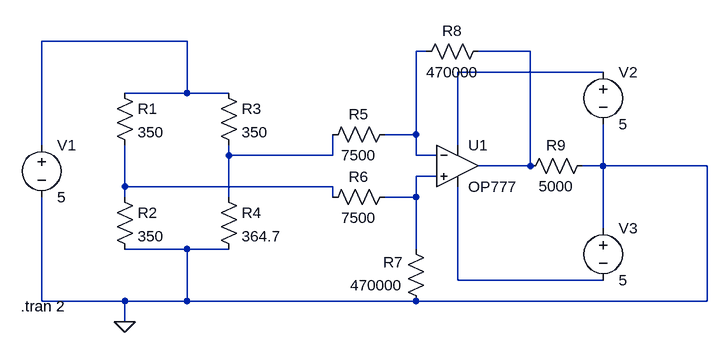
[diagram p0: schematic PuenteWGalgas.asc]
PuenteWGalgas.asc, the LTspice schematic file:
Version 4
SHEET 1 1060 680
WIRE 256 -16 32 -16
WIRE 624 0 608 0
WIRE 784 0 704 0
WIRE 896 32 672 32
WIRE 256 64 256 -16
WIRE 256 64 160 64
WIRE 320 64 256 64
WIRE 608 128 608 0
WIRE 608 128 560 128
WIRE 32 144 32 -16
WIRE 672 144 672 32
WIRE 320 160 320 144
WIRE 480 160 480 128
WIRE 480 160 320 160
WIRE 608 160 608 128
WIRE 640 160 608 160
WIRE 784 176 784 0
WIRE 784 176 704 176
WIRE 896 176 896 112
WIRE 896 176 864 176
WIRE 1056 176 896 176
WIRE 640 192 608 192
WIRE 160 208 160 144
WIRE 480 208 160 208
WIRE 160 224 160 208
WIRE 320 224 320 160
WIRE 480 224 480 208
WIRE 608 224 608 192
WIRE 608 224 560 224
WIRE 896 272 896 176
WIRE 256 304 160 304
WIRE 320 304 256 304
WIRE 608 304 608 224
WIRE 672 352 672 208
WIRE 896 352 672 352
WIRE 32 384 32 224
WIRE 160 384 32 384
WIRE 256 384 256 304
WIRE 256 384 160 384
WIRE 608 384 256 384
WIRE 1056 384 1056 176
WIRE 1056 384 608 384
WIRE 160 416 160 384
FLAG 160 416 0
SYMBOL voltage 32 128 R0
WINDOW 123 0 0 Left 0
WINDOW 39 0 0 Left 0
SYMATTR InstName V1
SYMATTR Value 5
SYMBOL res 144 48 R0
SYMATTR InstName R1
SYMATTR Value 350
SYMBOL res 144 208 R0
SYMATTR InstName R2
SYMATTR Value 350
SYMBOL res 304 48 R0
SYMATTR InstName R3
SYMATTR Value 350
SYMBOL res 304 208 R0
SYMATTR InstName R4
SYMATTR Value 364.7
SYMBOL res 576 112 R90
WINDOW 0 0 56 VBottom 2
WINDOW 3 32 56 VTop 2
SYMATTR InstName R5
SYMATTR Value 7500
SYMBOL res 576 208 R90
WINDOW 0 0 56 VBottom 2
WINDOW 3 32 56 VTop 2
SYMATTR InstName R6
SYMATTR Value 7500
SYMBOL res 624 400 R180
WINDOW 0 36 76 Left 2
WINDOW 3 36 40 Left 2
SYMATTR InstName R7
SYMATTR Value 470000
SYMBOL OpAmps\\OP777 672 112 R0
SYMATTR InstName U1
SYMBOL res 720 -16 R90
WINDOW 0 0 56 VBottom 2
WINDOW 3 32 56 VTop 2
SYMATTR InstName R8
SYMATTR Value 470000
SYMBOL res 880 160 R90
WINDOW 0 0 56 VBottom 2
WINDOW 3 32 56 VTop 2
SYMATTR InstName R9
SYMATTR Value 5000
SYMBOL voltage 896 16 R0
WINDOW 123 0 0 Left 0
WINDOW 39 0 0 Left 0
SYMATTR InstName V2
SYMATTR Value 5
SYMBOL voltage 896 256 R0
WINDOW 123 0 0 Left 0
WINDOW 39 0 0 Left 0
SYMATTR InstName V3
SYMATTR Value 5
TEXT 0 392 Left 2 !.tran 2

The netlist it stands for:
* PuenteWGalgas.asc
V1 N001 0 5
R1 N001 N007 350
R2 N007 0 350
R3 N001 N005 350
R4 N005 0 364.7
R5 N002 N005 7500
R6 N006 N007 7500
R7 0 N006 470000
XU1 N006 N002 N004 N008 N003 OP777  ; pins In+ In- V+ V- OUT
R8 N003 N002 470000
R9 0 N003 5000
V2 N004 0 5
V3 0 N008 5
.tran 2
.lib ADI.lib
.backanno
.end